# Altium project FAT94.PrjPCB
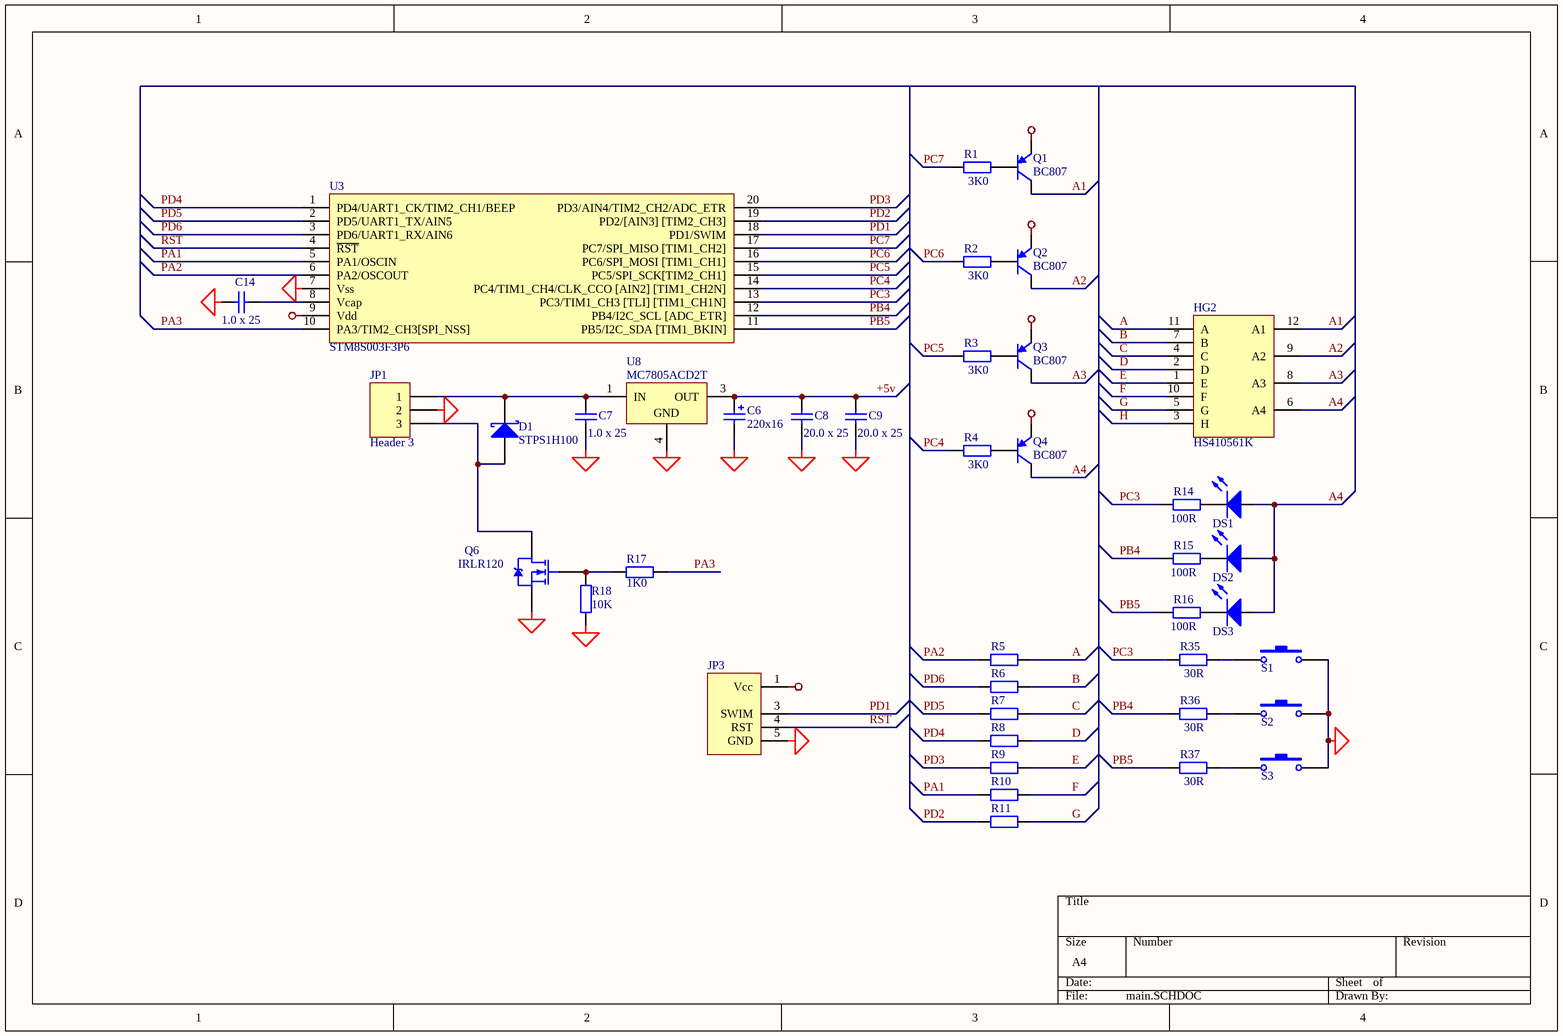
[diagram p0: main.SCHDOC]
1 sheet, 41 parts. Net scope: global (net labels, ports and power ports of the same name join across sheets).
Board file: fat94.PcbDoc

## Sheet main.SCHDOC
size A4

### Parts
C6  value 220x16  [el3]
C7  1.0 x 25  [_1206]
C8  20.0 x 25  [_1206]
C9  20.0 x 25  [_1206]
C14  1.0 x 25  [_1206]
D1  STPS1H100  [DSO-C2/X2.3]
DS1  LED0  [el3]  (value not drawn)
DS2  LED0  [el3]  (value not drawn)
DS3  LED0  [el3]  (value not drawn)
HG2  HS410561K  [KEM-3461BS]
JP1  Header 3  [BT5-3]
JP3  (no value)  [HDR1X5_uart]
Q1  BC807  [SO-G3]
Q2  BC807  [SO-G3]
Q3  BC807  [SO-G3]
Q4  BC807  [SO-G3]
Q6  IRLR120  [SIP-G3/E8]
R1  3K0  [_1206]
R2  3K0  [_1206]
R3  3K0  [_1206]
R4  3K0  [_1206]
R5  100R  [_1206]  (value not drawn)
R6  100R  [_1206]  (value not drawn)
R7  100R  [_1206]  (value not drawn)
R8  100R  [_1206]  (value not drawn)
R9  100R  [_1206]  (value not drawn)
R10  100R  [_1206]  (value not drawn)
R11  100R  [_1206]  (value not drawn)
R14  100R  [_1206]
R15  100R  [_1206]
R16  100R  [_1206]
R17  1K0  [_1206]
R18  10K  [_1206]
R35  30R  [_1206]
R36  30R  [_1206]
R37  30R  [_1206]
S1  SWT-6  [SWT-6]  (value not drawn)
S2  SWT-6  [SWT-6]  (value not drawn)
S3  SWT-6  [SWT-6]  (value not drawn)
U3  (no value)  [TSSO6x6-G20/Y1.6]
U8  MC7805ACD2T  [D2PAK]

### Nets
+5v: C6.1 C8.2 C9.2 JP3.1(Vcc) Q1.2(E) Q2.2(E) Q3.2(E) Q4.2(E) U3.9(Vdd) U8.3(OUT)
GND: C6.2 C7.1 C8.1 C9.1 C14.1 JP1.2 JP3.5(GND) Q6.3(S) R18.2 S1.2 S2.2 S3.2 U3.7(Vss) U8.4(GND)
A: HG2.11(A) R5.1
A1: HG2.12(A1) Q1.3(C)
A2: HG2.9(A2) Q2.3(C)
A3: HG2.8(A3) Q3.3(C)
A4: DS1.1(A) DS2.1(A) DS3.1(A) HG2.6(A4) Q4.3(C)
B: HG2.7(B) R6.1
C: HG2.4(C) R7.1
D: HG2.2(D) R8.1
E: HG2.1(E) R9.1
F: HG2.10(F) R10.1
G: HG2.5(G) R11.1
H: HG2.3(H)
PA1: R10.2 U3.5(PA1/OSCIN)
PA2: R5.2 U3.6(PA2/OSCOUT)
PA3: R17.1 U3.10(PA3/TIM2_CH3[SPI_NSS])
PB4: R15.2 R36.2 U3.12(PB4/I2C_SCL_[ADC_ETR])
PB5: R16.2 R37.2 U3.11(PB5/I2C_SDA_[TIM1_BKIN])
PC3: R14.2 R35.2 U3.13(PC3/TIM1_CH3_[TLI]_[TIM1_CH1N])
PC4: R4.2 U3.14(PC4/TIM1_CH4/CLK_CCO_[AIN2]_[TIM1_CH2N])
PC5: R3.2 U3.15(PC5/SPI_SCK[TIM2_CH1])
PC6: R2.2 U3.16(PC6/SPI_MOSI_[TIM1_CH1])
PC7: R1.2 U3.17(PC7/SPI_MISO_[TIM1_CH2])
PD1: JP3.3(SWIM) U3.18(PD1/SWIM)
PD2: R11.2 U3.19(PD2/[AIN3]_[TIM2_CH3])
PD3: R9.2 U3.20(PD3/AIN4/TIM2_CH2/ADC_ETR)
PD4: R8.2 U3.1(PD4/UART1_CK/TIM2_CH1/BEEP)
PD5: R7.2 U3.2(PD5/UART1_TX/AIN5)
PD6: R6.2 U3.3(PD6/UART1_RX/AIN6)
RST: JP3.4(RST) U3.4(~{RST})
NetC7_2: C7.2 D1.2(K) JP1.1 U8.1(IN)
NetC14_2: C14.2 U3.8(Vcap)
NetD1_1: D1.1(A) JP1.3 Q6.4(D)
NetDS1_2: DS1.2(K) R14.1
NetDS2_2: DS2.2(K) R15.1
NetDS3_2: DS3.2(K) R16.1
NetQ1_1: Q1.1(B) R1.1
NetQ2_1: Q2.1(B) R2.1
NetQ3_1: Q3.1(B) R3.1
NetQ4_1: Q4.1(B) R4.1
NetQ6_1: Q6.1(G) R17.2 R18.1
NetR35_1: R35.1 S1.1
NetR36_1: R36.1 S2.1
NetR37_1: R37.1 S3.1

### Library data of the parts
C6 = Cap Pol: Polarized Capacitor (Radial); Manufacturer: Generic Components; Class I: Passive; Published: 8-Jun-2000; Revision: July-2002: Re-released for DXP Platform.; Publisher: Altium Limited; Class II: Capacitor
C7-C9 = Cap: Capacitor; Manufacturer: Generic Components; Class I: Passive; Value: 1.0; Published: 8-Jun-2000; Revision: July-2002: Re-released for DXP Platform.; Publisher: Altium Limited; Class II: Capacitor
C14 = Cap Semi: Capacitor; Manufacturer: Generic Components; Class I: Passive; Value: 0,1; Published: 8-Jun-2000; Revision: July-2002: Re-released for DXP Platform.; Publisher: Altium Limited; Class II: Capacitor
D1 = 10BQ015: Schottky Rectifier; Manufacturer: International Rectifier; Revision 1: 10-July-2000: SIM Model Added.; Revision 2: July-2002: Re-released for DXP Platform.; Class I: Discrete; Class II: Rectifier - Schottky; Published: 8-Jun-2000; Datasheet: Latest Revision: PD-2.396A; Package Reference: DO-214AA; Publisher: Altium Limited
DS1-DS3 = LED0: Typical INFRARED GaAs LED; Manufacturer: Generic Components; Class I: Optoelectronic; Published: 8-Jun-2000; Revision: July-2002: Re-released for DXP Platform.; Publisher: Altium Limited; Class II: LED
JP1 = Header 3: Header, 3-Pin; Manufacturer: Generic Components; Class I: Connector; Revision: July-2002: Re-released for DXP Platform.; Publisher: Altium Limited
JP3 = SWIM_CONN
Q1-Q4 = BC857ALT1: General Purpose Transistor PNP Silicon; Manufacturer: Motorola; Package Information: Latest Revision: 1997; Class I: Discrete; Class II: BJT - Low Power; Published: 29-Sep-2000; Revision: July-2002: Re-released for DXP Platform.; Datasheet: Latest Revision: 1997; Package Reference: 318-08; Publisher: Altium Limited
Q6 = IRFR120: HEXFET N-Channel Power MOSFET; Manufacturer: International Rectifier; Revision 1: 10-July-2000: SIM Model Added.; Revision 2: July-2002: Re-released for DXP Platform.; Class I: Discrete; Class II: MOSFET - Power; Note: Pin 2 is trimmed and is electrically connected to Drain.; Published: 8-Jun-2000; Datasheet: Latest Revision: PD-9.523D; Package Reference: TO-252AA; Publisher: Altium Limited
R1 R35-R37 = Res2: Resistor; Manufacturer: Generic Components; Class I: Passive; Value: 1K0; Published: 8-Jun-2000; Revision: July-2002: Re-released for DXP Platform.; Publisher: Altium Limited; Class II: Resistor
R2-R4 = Res2: Resistor; Manufacturer: Generic Components; Class I: Passive; Value: 2K0; Published: 8-Jun-2000; Revision: July-2002: Re-released for DXP Platform.; Publisher: Altium Limited; Class II: Resistor
R5-R11 R14-R16 = Res2: Resistor; Manufacturer: Generic Components; Class I: Passive; Published: 8-Jun-2000; Revision: July-2002: Re-released for DXP Platform.; Publisher: Altium Limited; Class II: Resistor; Value: 100R
R17 R18 = Res2: Resistor; Manufacturer: Generic Components; Class I: Passive; Value: 1K; Published: 8-Jun-2000; Revision: July-2002: Re-released for DXP Platform.; Publisher: Altium Limited; Class II: Resistor
S1-S3 = SWT-6: Switch; Manufacturer: Generic Components; Published: 24-Mar-1999; Revision: July-2002: Re-released for DXP Platform.; Publisher: Altium Limited
U3 = STM8S103F
U8 = MC7805ACD2T: Three-Terminal Positive Voltage Regulator; Manufacturer: ON Semiconductor; Package Information: Latest Revision: 1997; Class I: Power Management; Note: Pin 2 is electrically connected to Pin 4; Pin 2 is trimmed and not drawn;; Published: 15-Apr-2002; Datasheet: Latest Revision: 1997; Package Reference: 936-03; Publisher: Altium Limited; Class II: Voltage Regulator